# EAGLE design pizaid (EAGLE 6.5.0)
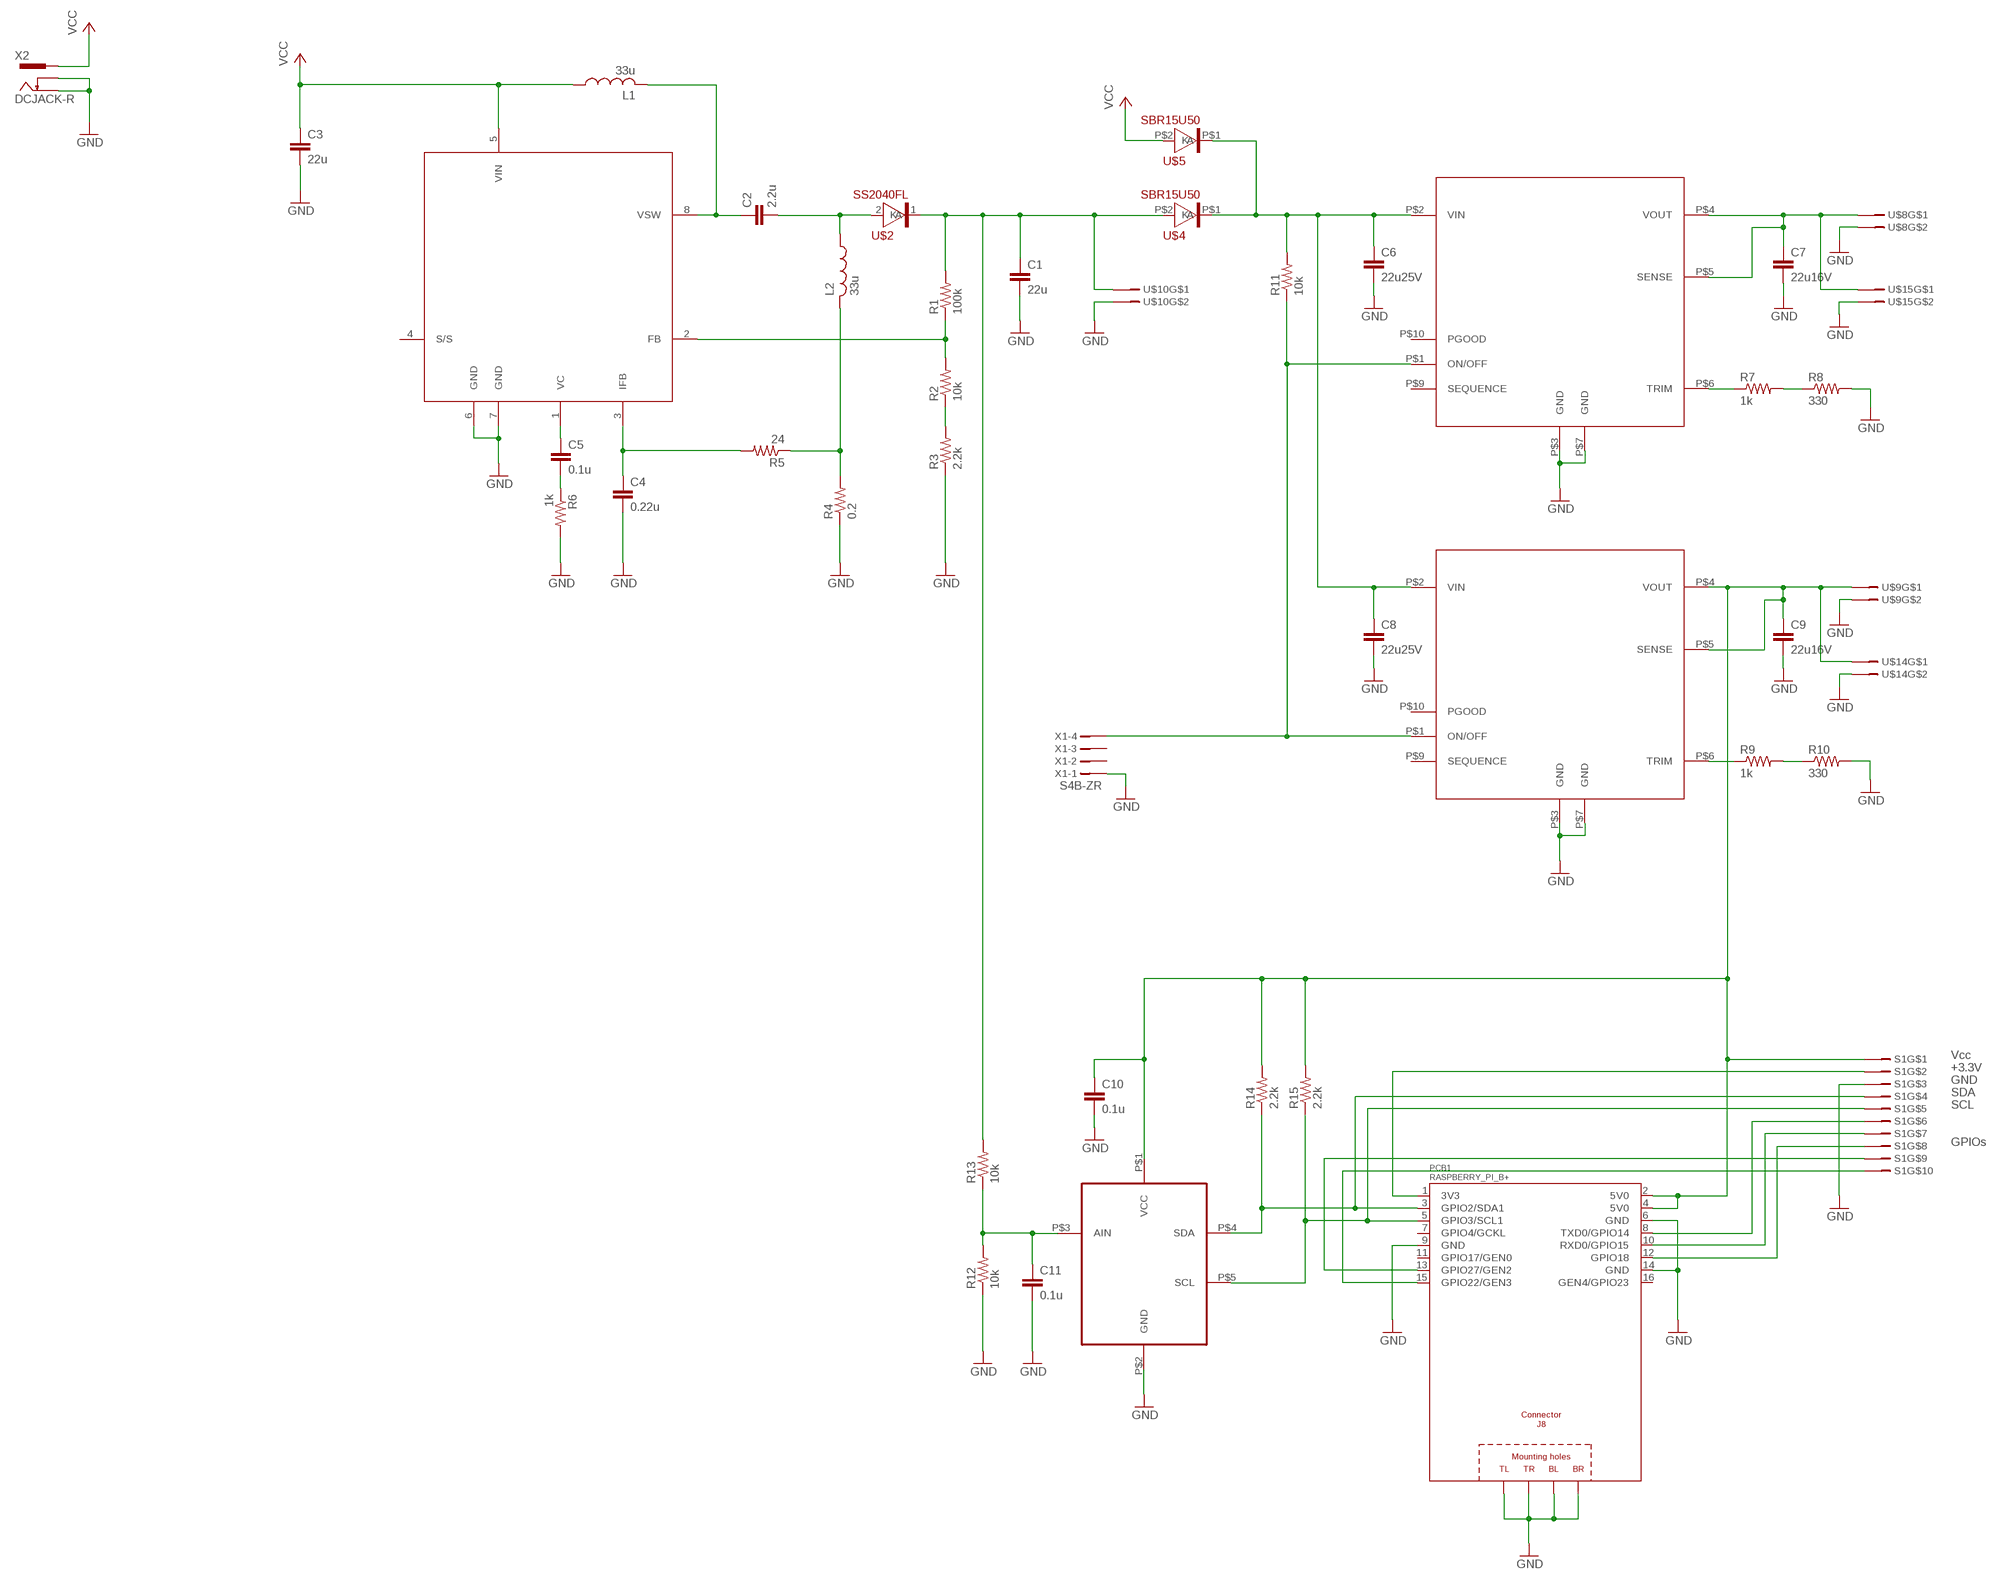
[diagram p0: schematic, sheet 1]

## Parts
C1  22u  C-EUC3225  [C3225]
C2  2.2u  C-EUC3216  [C3216]
C3  22u  C-EUC3225  [C3225]
C4  0.22u  C-EUC0603  [C0603]
C5  0.1u  C-EUC0603  [C0603]
C6  22u25V  C-EUC3225  [C3225]
C7  22u16V  C-EUC3225  [C3225]
C8  22u25V  C-EUC3225  [C3225]
C9  22u16V  C-EUC3225  [C3225]
C10  0.1u  C-EUC0603  [C0603]
C11  0.1u  C-EUC0603  [C0603]
L1  33u  L-USL5650M  [L5650M]
L2  33u  L-USL5650M  [L5650M]
PCB1  RASPBERRY_PI_B+  [RASPBERRY_PI_B+]
R1  100k  R-US_R0603  [R0603]
R2  10k  R-US_R0603  [R0603]
R3  2.2k  R-US_R0603  [R0603]
R4  0.2  R-US_0204/7  [0204/7]
R5  24  R-US_R0603  [R0603]
R6  1k  R-US_R0603  [R0603]
R7  1k  R-US_R0603  [R0603]
R8  330  R-US_R0603  [R0603]
R9  1k  R-US_R0603  [R0603]
R10  330  R-US_R0603  [R0603]
R11  10k  R-US_R0603  [R0603]
R12  10k  R-US_R0603  [R0603]
R13  10k  R-US_R0603  [R0603]
R14  2.2k  R-US_R0603  [R0603]
R15  2.2k  R-US_R0603  [R0603]
S1  10B-PH  [S10B-PH]
U$1  LT1512CS8  [SOP8]
U$2  SS2040FL  [SOD-123FL]
U$4  SBR15U50  [POWERDI5]
U$5  SBR15U50  [POWERDI5]
U$6  OKL-T/6  [OKL-T/6]
U$7  OKL-T/6  [OKL-T/6]
U$8  B2P-VH  [B2P-VH]
U$9  B2P-VH  [B2P-VH]
U$10  B2P-VH  [B2P-VH]
U$14  B2P-VH  [B2P-VH]
U$15  B2P-VH  [B2P-VH]
U$16  MCP3021  [SOT-23]
X1  S4B-ZR  [S4B-ZR]
X2  DCJACK-R  [2DC-0005D100-R]

## Nets
3V3@1: PCB1.1(3V3) S1.P$2
5V0@2: C9.1 C10.1 PCB1.2(5V0) PCB1.4(5V0) R14.2 R15.2 S1.P$1 U$7.P$4(VOUT) U$7.P$5(SENSE) U$9.P$1 U$14.P$1 U$16.P$1(VCC)
GND: C1.2 C3.2 C4.2 C6.2 C7.2 C8.2 C9.2 C10.2 C11.2 PCB1.PE_BL(BL) PCB1.PE_BR(BR) PCB1.PE_TL(TL) PCB1.PE_TR(TR) R3.1 R4.1 R6.2 R8.2 R10.2 R12.1 S1.P$3 U$1.6(GND) U$1.7(GND) U$6.P$3(GND) U$6.P$7(GND) U$7.P$3(GND) U$7.P$7(GND) U$8.P$2 U$9.P$2 U$10.P$2 U$14.P$2 U$15.P$2 U$16.P$2(GND) X1.1 X2.2 X2.3
GND@1: PCB1.9(GND) ; supply symbol labelled GND
GND@4: PCB1.6(GND) PCB1.14(GND) ; supply symbol labelled GND
JNET: C7.1 U$6.P$4(VOUT) U$6.P$5(SENSE) U$8.P$1 U$15.P$1
N$1: R2.1 R3.2
N$2: C2.1 L1.2 U$1.8(VSW)
N$3: C1.1 R1.2 R13.2 U$2.1(K) U$4.P$2(A) U$10.P$1
N$4: L2.2 R4.2 R5.1
N$5: C4.1 R5.2 U$1.3(IFB)
N$6: C5.1 U$1.1(VC)
N$7: C5.2 R6.1
N$8: C6.1 C8.1 R11.2 U$4.P$1(K) U$5.P$1(K) U$6.P$2(VIN) U$7.P$2(VIN)
N$9: PCB1.15(GPIO22/GEN3) S1.P$10
N$10: R1.1 R2.2 U$1.2(FB)
N$11: C2.2 L2.1 U$2.2(A)
N$12: R11.1 U$6.P$1(ON/OFF) U$7.P$1(ON/OFF) X1.4
N$13: PCB1.8(TXD0/GPIO14) S1.P$6
N$14: R9.1 U$7.P$6(TRIM)
N$15: R9.2 R10.1
N$16: PCB1.5(GPIO3/SCL1) R15.1 S1.P$5 U$16.P$5(SCL)
N$17: R7.1 U$6.P$6(TRIM)
N$18: R7.2 R8.1
N$19: C11.1 R12.2 R13.1 U$16.P$3(AIN)
N$20: PCB1.3(GPIO2/SDA1) R14.1 S1.P$4 U$16.P$4(SDA)
N$21: PCB1.10(RXD0/GPIO15) S1.P$7
N$22: PCB1.12(GPIO18) S1.P$8
N$23: PCB1.13(GPIO27/GEN2) S1.P$9
VCC: C3.1 L1.1 U$1.5(VIN) U$5.P$2(A) X2.1
Unconnected: PCB1.7(GPIO4/GCKL) PCB1.11(GPIO17/GEN0) PCB1.16(GEN4/GPIO23) U$1.4(S/S) U$6.P$9(SEQUENCE) U$6.P$10(PGOOD) U$7.P$9(SEQUENCE) U$7.P$10(PGOOD) X1.2 X1.3

## Notes on the sheet
- Vcc
- +3.3V
- GND
- SDA
- SCL
- GPIOs

## Library data of the parts
C1-C11 = rcl:C-EU: CAPACITOR, European symbol
L1 L2 = rcl:L-US: INDUCTOR, American symbol
PCB1 = pizaid:RASPBERRY_PI_B+: Raspberry Pi B+ Based on issue: Thursday, July 10, 2014 - Rev 1.2 LBR by Tim R. 07-2014
R1-R15 = rcl:R-US_: RESISTOR, American symbol
S1 = con-jst:?10B-PH
U$1 = pizaid:LT1512
U$2 = pizaid:SS2040FL
U$4 U$5 = pizaid:SBR15U50
U$6 U$7 = pizaid:OKL-T/6
U$8-U$10 U$14 U$15 = pizaid:B2P-VH
U$16 = pizaid:MCP3021
X1 = con-jst:?4B-ZR: ZH CONNECTOR 1.5 mm, 4 pin 1 row Source: http://www.jst.com .. eZH.pdf; MF: FARNELL; MPN: S4B-ZR(LF)(SN); OC_FARNELL: 9491830; OC_NEWARK: 38K8076
X2 = kamiki-dcjack:DCJACK: DC JACK 2.1mmφ - 5.5mmφ DCジャック、基板用。

## Board
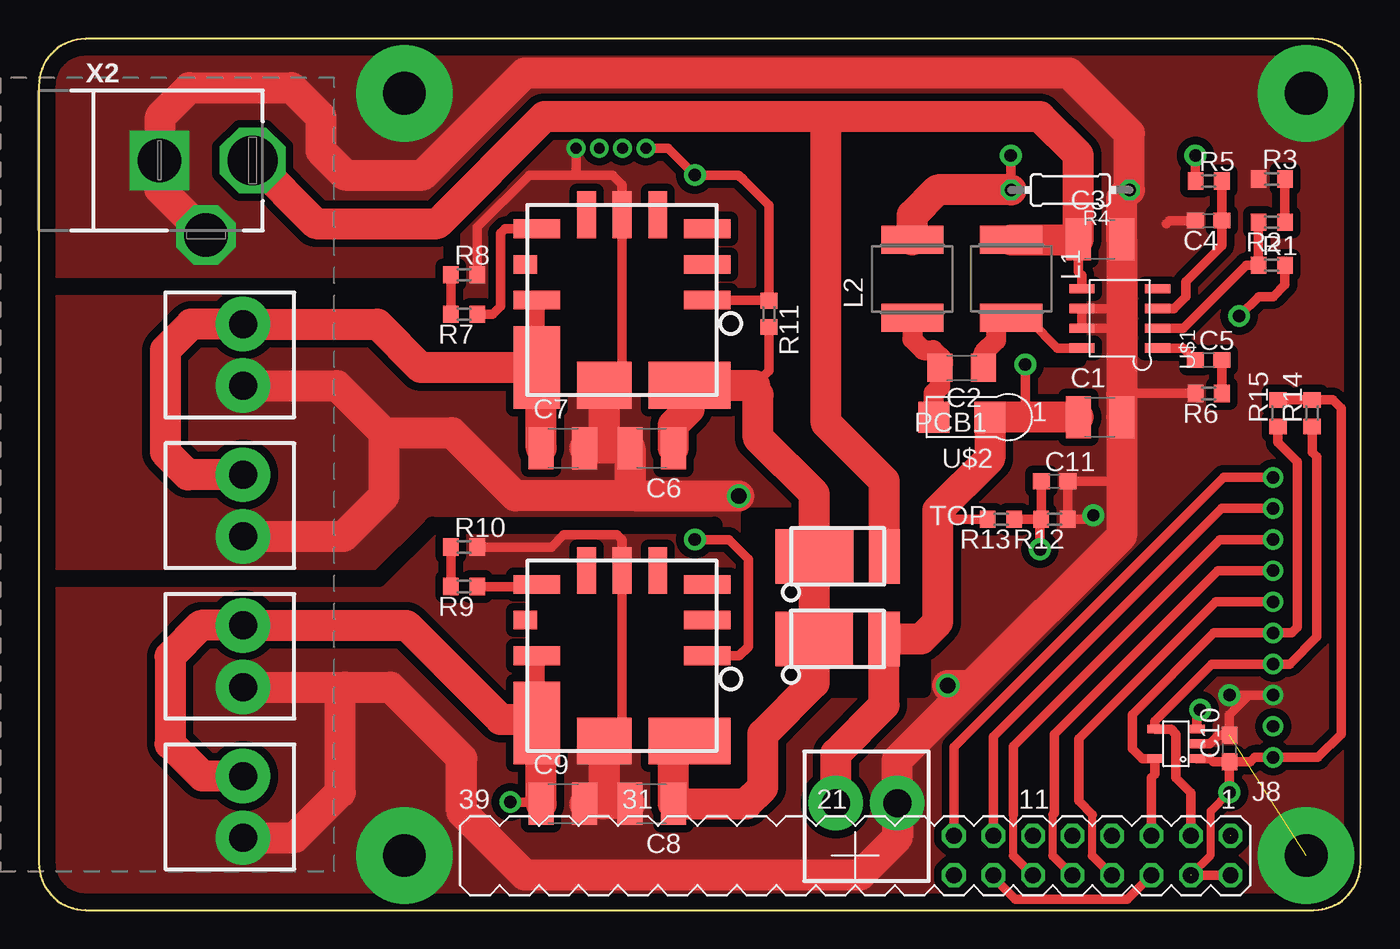
[diagram p1: board, top side]
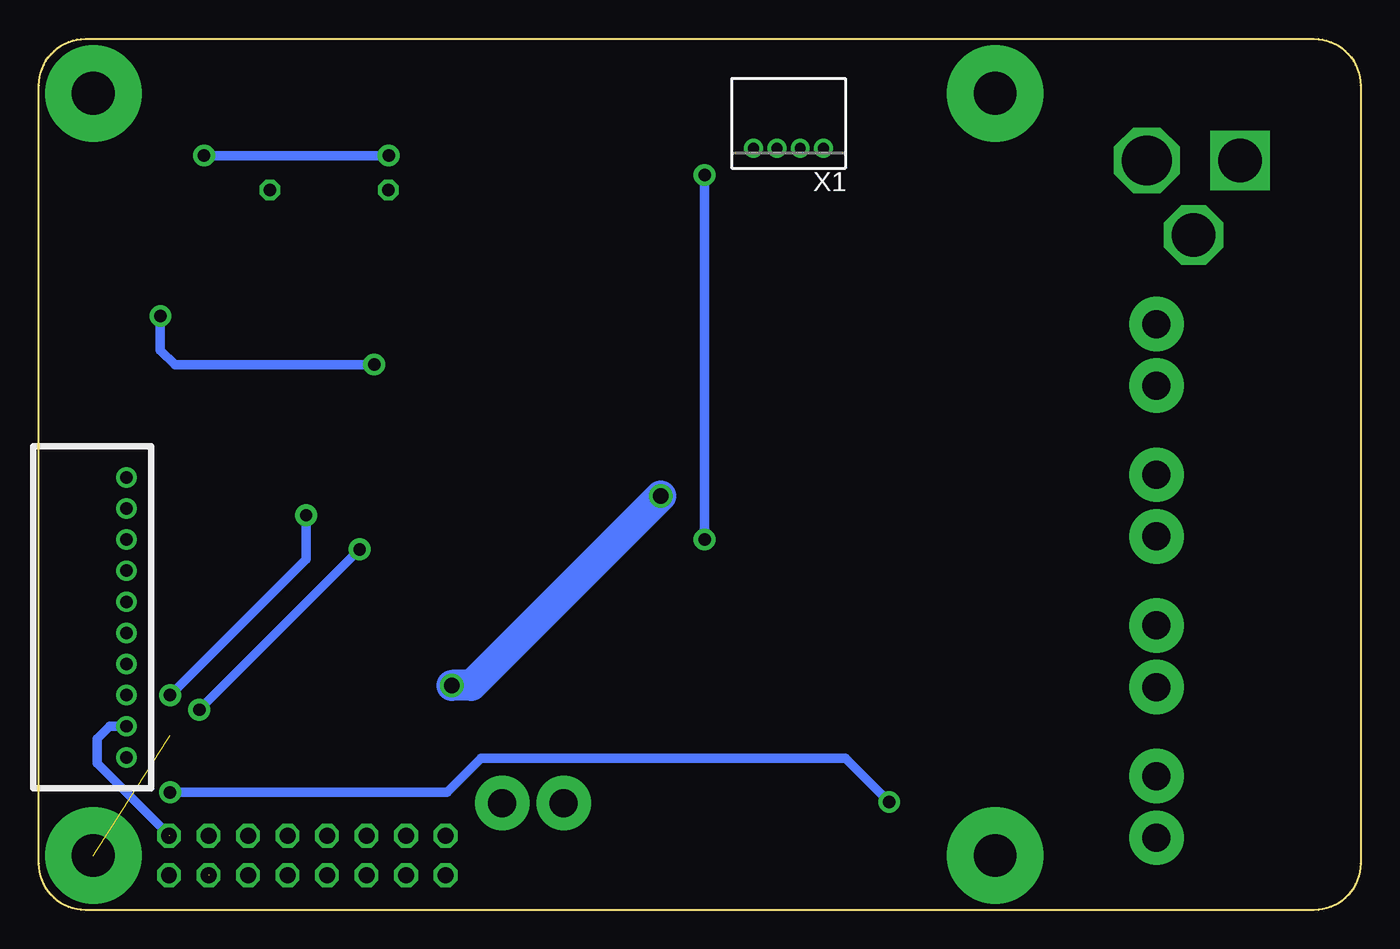
[diagram p2: board, bottom side, seen from below]

Size 85 x 56 mm. Coordinates in mm from the lower left corner, seen from the top.
Copper layers (1*16): Top 0.035mm / dielectric 1.5mm / Bottom 0.035mm
Design rules "default": minimum track width 10mil, minimum drill 0.6mm, track to track 8mil, track to pad 8mil, pad to pad 8mil, via to via 8mil, smd to smd 8mil, copper to edge 40mil, drill to drill 8mil, minimum pad ring 10mil, minimum via ring 8mil, stop-mask expansion 4mil, vias tented up to drill 0mil, thermal gap 10mil
tRestrict: area 51.9,35.4 to 66.9,45.4; area 31.9,10.7 to 43.1,21.9; area 31.9,33.5 to 43.1,44.8; area 45.6,14.1 to 56.9,25.4; 5 lines

### Footprints (pad centres in the part's own frame; a part is rotated, then mirrored left to right if it is on the bottom)
C3225 = smd 1.6 x 2.7: 1 -1.4,0; 2 1.4,0
C3216 = smd 1.6 x 1.8: 1 -1.4,0; 2 1.4,0
C0603 = smd 1.1 x 1: 1 -0.85,0; 2 0.85,0
L5650M = smd 1.8 x 4: 1 -2.5,0; 2 2.5,0
RASPBERRY_PI_B+ = drill 1.016 octagon: 1 8.37,51.23; 2 8.37,53.77; 3 10.91,51.23; 4 10.91,53.77; 5 13.45,51.23; 6 13.45,53.77; 7 15.99,51.23; 8 15.99,53.77; 9 18.53,51.23; 10 18.53,53.77; 11 21.07,51.23; 12 21.07,53.77; 13 23.61,51.23; 14 23.61,53.77; 15 26.15,51.23; 16 26.15,53.77 | drill 2.75 pad 6.2: PE_BL 3.5,3.5; PE_BR 61.5,3.5; PE_TL 3.5,52.5; PE_TR 61.5,52.5
R0603 = smd 1 x 1.1: 1 -0.85,0; 2 0.85,0
0204/7 = drill 0.813 octagon: 1 -3.81,0; 2 3.81,0
S10B-PH = drill 0.8: P$1 -9,0; P$2 -7,0; P$3 -5,0; P$4 -3,0; P$5 -1,0; P$6 1,0; P$7 3,0; P$8 5,0; P$9 7,0; P$10 9,0
SOP8 = smd 0.6 x 1.62: 1 -1.905,-2.44; 2 -0.635,-2.44; 3 0.635,-2.44; 4 1.905,-2.44; 5 1.905,2.44; 6 0.635,2.44; 7 -0.635,2.44; 8 -1.905,2.44
SOD-123FL = smd 2 x 2: 1 -1.8,0; 2 1.8,0
POWERDI5 = smd 5 x 3.5: P$1 1.5,0 | smd 2 x 3.5: P$2 -3,0
OKL-T/6 = smd 3 x 1.2: P$1 -5.48,0; P$5 5.48,0; P$6 5.48,-4.58; P$9 -5.48,-4.58; P$10 -5.48,-2.29 | smd 5.29 x 3: P$2 -4.335,5.48 | smd 3.49 x 3: P$3 1.145,5.48 | smd 3 x 5.29: P$4 5.48,4.335 | smd 1.2 x 3: P$7 0,-5.48; P$8 -2.29,-5.48; P$12 2.29,-5.48 | smd 1.5 x 1.2: P$11 6.23,-2.29
B2P-VH = drill 1.8 pad 3.5: P$1 -1.98,0; P$2 1.98,0
SOT-23 = smd 0.55 x 1: P$1 -0.95,-1.35; P$2 0,-1.35; P$3 0.95,-1.35; P$4 0.95,1.35; P$5 -0.95,1.35
S4B-ZR = drill 0.7 pad 1.1: 1 -2.25,0; 2 -0.75,0; 3 0.75,0; 4 2.25,0
2DC-0005D100-R = drill 3.2 pad 4 octagon: 1 3.75,0 | drill 2.8 pad 3.5 square: 2 -2.25,0 | drill 2.8 pad 3.5 octagon: 3 0.75,-4.8

### Placement (x,y rotation side)
C1  68.24,31.68 0 top
C2  59.35,34.86 180 top
C3  68.24,43.11 0 top
C4  75.22,44.32 180 top
C5  75.22,35.35 0 top
C6  39.41,29.69 180 top
C7  33.7,29.69 0 top
C8  39.41,6.82 180 top
C9  33.7,6.82 0 top
C10  76.56,10.38 90 top
C11  65.31,27.56 0 top
L1  62.52,40.57 270 top
L2  56.17,40.57 90 top
PCB1  85,56 180 top
R1  79.28,41.45 0 top
R2  79.28,44.22 180 top
R3  79.28,46.99 0 top
R4  66.33,46.29 180 top
R5  75.22,46.86 0 top
R6  75.22,33.2 180 top
R7  27.34,38.29 180 top
R8  27.34,40.83 0 top
R9  27.34,20.8 180 top
R10  27.34,23.34 0 top
R11  46.96,38.31 270 top
R12  65.31,25.12 180 top
R13  61.88,25.12 180 top
R14  81.88,31.94 90 top
R15  79.69,31.94 90 top
S1  79.38,18.81 90 bottom
U$1  69.51,38.03 90 top
U$2  59.35,31.68 180 top
U$4  51.36,17.43 180 top
U$5  51.37,22.74 180 top
U$6  37.51,39.21 180 top
U$7  37.51,16.35 180 top
U$8  13.12,26 270 top
U$9  13.12,6.62 270 top
U$10  53.23,6.88 0 top
U$14  13.12,16.31 270 top
U$15  13.12,35.69 270 top
U$16  73.12,10.69 90 top
X1  36.79,48.97 180 bottom
X2  10,48.19 0 top

### Tracks (layer width: path | path; a pad name or v marks a point on that pad's centre or on a via)
3V3@1  (1 unrouted)
  Bottom 0.6: 76.63,4.82 81.25,9.44 81.25,11 80.44,11.81 S1.P$2
5V0@2  (via drill 0.8 pad 1.4)  (1 unrouted)
  Top 0.5: 74.09,2.25 75.36,3.53 75.36,6.36 v76.56,7.56
  Top 0.6: R15.2 R14.2 83.21,32.79 83.75,32.25 83.75,11.31 82.25,9.81 S1.P$1 78.19,9.81 77.9,9.53 C10.1 | U$16.P$1 75.3,9.74 75.31,9.75 75.54,9.53 C10.1 | C10.1 v76.56,7.56 | 32.23,6.89 C9.1 32.18,6.94 v30.31,6.94 | PCB1.2 PCB1.4
  Top 1: U$7.P$5 U$7.P$4
  Top 2: C9.1 32.3,11.74 U$7.P$4 31.79,12.25 29.69,12.25 23.64,18.29 U$14.P$1 10.42,18.29 8.44,16.31 8.44,10.69 10.52,8.61 U$9.P$1
  Bottom 0.6: v76.56,7.56 58.75,7.56 56.56,9.75 33.12,9.75 v30.31,6.94
GND  (via drill 0.8 pad 1.4, 1 pad 1.4, 1 pad 1.5)  (1 unrouted)
  Top 0.6: 69.06,37.25 68.92,37.4 U$1.7 U$1.6 69.49,38.67 69.64,38.81 | R10.2 32.96,23.34 33.75,24.12 37.19,24.12 37.5,23.81 U$7.P$7 37.51,21.63 37.5,21.62 37.5,11.62 | 37.5,11.62 37.5,11.31 | R8.2 28.2,43.88 31.56,47.25 34.69,47.25 | 34.69,47.25 36.87,47.25 37.51,46.62 U$6.P$7 37.51,44.13 37.5,44.12 37.5,33.81 36.44,33.81 U$6.P$3 | C4.2 72.7,44.32 72.5,44.12 | R6.2 69.66,33.2 69.64,33.19 | U$16.P$2 75.31,10.69 75.85,11.22 C10.2 76.56,12.56 77.81,13.81 S1.P$3 v76.56,13.81 | 69.64,27.56 C11.2 R12.1 67.56,25.12 v67.81,25.38 | U$7.P$3 37.12,11.62 37.5,11.62 | X1.1 34.54,47.4 34.69,47.25
  Top 2: 36.25,29.69 C6.2 38.01,27.05 38.44,26.62 | 36.25,29.69 C7.2 | U$6.P$3 36.36,29.8 36.25,29.69 | C8.2 36.25,6.82 | 36.25,6.82 C9.2 | U$7.P$3 36.36,6.94 36.25,6.82 | 38.44,26.62 v45,26.62 | 38.44,26.62 30.62,26.62 26.56,30.69 22.19,30.69 | U$14.P$2 19.69,14.33 | 19.69,14.33 22.61,14.33 27.19,9.75 27.19,6.31 31.25,2.25 52.81,2.25 55.21,4.64 U$10.P$2 55.21,9.64 60,14.44 | U$9.P$2 16.46,4.64 19.37,7.56 19.37,14.02 19.69,14.33 | U$8.P$2 19.58,24.02 22.19,26.62 22.19,30.69 | 22.19,30.69 19.17,33.71 U$15.P$2 | 60,14.44 69.64,24.07 69.64,27.56 C1.2 69.64,33.19 69.64,38.81 C3.2 69.64,45.78 R4.1 70.14,49.92 66.25,53.81 31.25,53.81 24.69,47.25 19.69,47.25 18.12,48.81 18.12,51 16.25,52.88 9.69,52.88 7.8,50.99 7.8,48.24 X2.2 7.75,46.39 X2.3 | v58.44,14.44 60,14.44
  Bottom 0.6: v67.81,25.38 67.81,22.56 v76.56,13.81
  Bottom 2: v45,26.62 57.19,14.44 v58.44,14.44
  pour Top (isolate 0.5, no thermals): -0.31,-0.25 85.31,-0.25 85.31,56 -0.31,56
GND@4
  Top 0.6: PCB1.6 70.01,0.69 62.81,0.69 61.39,2.11 PCB1.14
JNET
  Top 1: U$6.P$5 U$6.P$4
  Top 2: C7.1 32.3,34.6 U$6.P$4 24.56,34.88 21.77,37.67 U$15.P$1 9.79,37.67 8.12,36 8.12,29.44 9.58,27.98 U$8.P$1
N$1
  Top 0.6: R2.1 R3.2
N$2
  Top 0.6: U$1.8 65.5,36.13 63.75,37.88 62.72,37.88 L1.2
  Top 1.3: C2.1 60.75,35.81 61.56,36.62 61.56,37.88 62.33,37.88 L1.2
N$3  (via drill 0.8 pad 1.4)
  Top 0.6: v63.44,35.06 63.44,31.68 | R1.2 80.14,40.2 79.37,39.44 78.44,39.44 v77.19,38.19 | R13.2 58.19,25.12 57.81,24.75
  Top 2: C1.1 63.44,31.68 U$2.1 61.15,29.02 57.81,25.69 57.81,24.75 57.81,18.5 56.74,17.43 U$4.P$2 54.36,13.17 51.25,10.06 U$10.P$1
  Bottom 0.6: v63.44,35.06 76.25,35.06 77.19,36 v77.19,38.19
N$4  (via drill 0.8 pad 1.4)
  Top 0.6: R4.2 62.52,48.48 v62.5,48.5 | v74.37,48.5 R5.1
  Top 2: L2.2 56.17,44.67 57.79,46.29 R4.2
  Bottom 0.6: v62.5,48.5 v74.37,48.5
N$5
  Top 0.6: R5.2 C4.1 76.07,42.7 73.75,40.38 73.75,39.44 72.98,38.67 U$1.3
N$6
  Top 0.6: U$1.1 73.6,36.13 C5.1
N$7
  Top 0.6: R6.1 C5.2
N$8
  Top 0.6: R11.2 46.96,34.67 46.02,33.73
  Top 2: U$7.P$2 40.81,9.84 C8.1 45.51,6.82 46.56,7.88 46.56,11.31 49.86,14.61 U$4.P$1 49.86,22.73 U$5.P$1 49.87,26.75 46.25,30.38 46.25,33.1 45.62,33.73 | C6.1 40.81,31.19 41.84,32.22 U$6.P$2 45.62,33.73 | 45.62,33.73 46.02,33.73
N$9
  Top 0.6: S1.P$10 76.19,27.81 58.85,10.47 PCB1.15
N$10
  Top 0.6: U$1.2 73.58,37.4 77.64,41.45 R1.1 R2.2
N$11
  Top 1.3: L2.1 56.17,36.7 56.87,36 57.5,36 58.12,35.38 58.12,35.03 C2.2 57.95,33.63 57.55,33.23 U$2.2
N$12  (via drill 0.8 pad 1.4)
  Top 0.6: U$7.P$1 45.04,16.35 45.62,16.94 45.62,22.56 44.37,23.81 v42.19,23.81 | U$6.P$1 46.91,39.21 R11.1 46.96,45.29 45.31,46.94 45,47.25 v42.19,47.25 40.47,48.97 X1.4
  Bottom 0.6: v42.19,23.81 v42.19,47.25
N$13
  Top 0.5: 67.76,3.48 67.76,6.12
  Top 0.6: S1.P$6 75.69,19.81 66.87,11 66.87,7.01 67.76,6.12 | PCB1.8 67.76,3.48
N$14
  Top 0.6: R9.1 31.89,20.8 U$7.P$6
N$15
  Top 0.6: R9.2 R10.1
N$16
  Top 0.6: R15.1 79.69,30.06 80.94,28.81 80.94,18.19 80.56,17.81 S1.P$5 75.56,17.81 70.31,12.56 70.31,10.38 70.95,9.74 U$16.P$5 71.78,8.71 71.55,8.49 PCB1.5
N$17
  Top 0.6: U$6.P$6 29.98,43.79 29.69,43.5 29.69,38.81 29.17,38.29 R7.1
N$18
  Top 0.6: R7.2 R8.1
N$19  (via drill 0.8 pad 1.4)
  Top 0.6: R13.1 R12.2 | R12.2 C11.1 | U$16.P$3 74.47,12.66 v74.69,12.88 | v64.37,23.19 64.37,25.04 R12.2
  Bottom 0.6: v74.69,12.88 v64.37,23.19
N$20
  Top 0.6: R14.1 81.87,29.44 82.19,29.12 82.19,17.56 80.44,15.81 S1.P$4 75.44,15.81 71.78,12.15 U$16.P$4 71.79,11.62 72.81,11.62 73.12,11.31 73.12,8.5 74.09,7.54 PCB1.3
N$21
  Top 0.5: 65.21,3.49 65.21,6.12
  Top 0.6: S1.P$7 75.81,21.81 65.31,11.31 65.31,6.22 65.21,6.12 | PCB1.10 65.21,3.49
N$22
  Top 0.5: 62.66,3.5 62.66,6.12
  Top 0.6: S1.P$8 75.94,23.81 62.66,10.54 62.66,6.12 | PCB1.12 62.66,3.5
N$23
  Top 0.6: S1.P$9 76.06,25.81 61.39,11.14 PCB1.13
VCC
  Top 0.6: U$1.5 67.07,40.81 66.84,41.04 C3.1
  Top 2: L1.1 66.8,43.07 C3.1 66.84,48.54 64.37,51 50.62,51 | U$5.P$2 54.37,27.57 50.62,31.31 50.62,51 | 50.62,51 32.5,51 25.62,44.12 17.81,44.12 X2.1